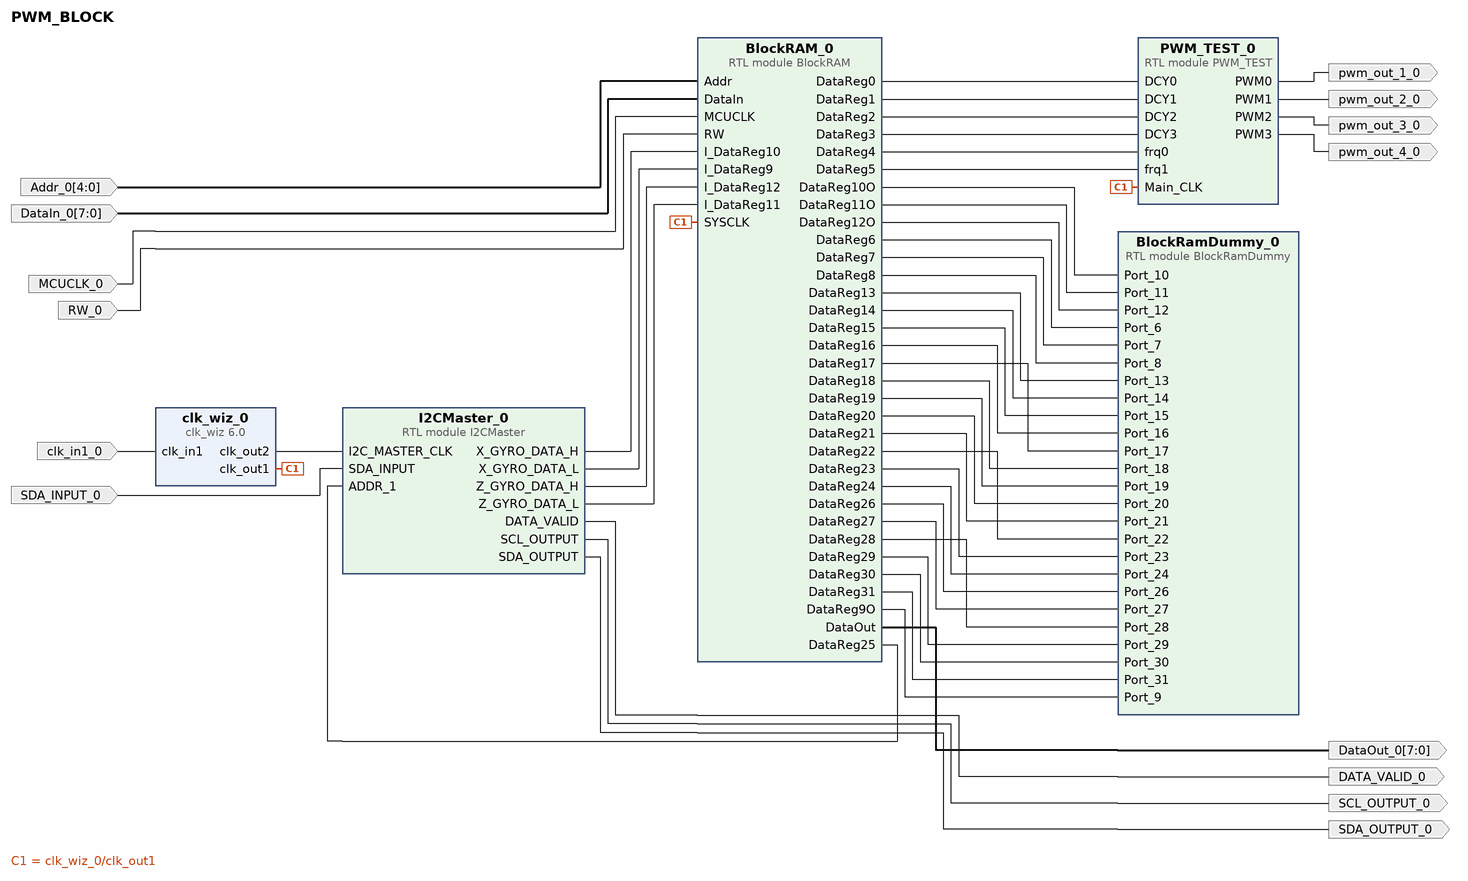
[diagram p0: block diagram of the top level]
# Vivado block design PWM_BLOCK, xc7a35tcpg236-1, Vivado 2022.2
create_bd_design PWM_BLOCK

create_bd_port -dir I -type clk clk_in1_0
set_property -dict {CONFIG.FREQ_HZ 12000000} [get_bd_ports clk_in1_0]
create_bd_port -dir O pwm_out_3_0
create_bd_port -dir O pwm_out_1_0
create_bd_port -dir O pwm_out_2_0
create_bd_port -dir O pwm_out_4_0
create_bd_port -dir I -from 7 -to 0 DataIn_0
create_bd_port -dir I RW_0
create_bd_port -dir I -from 4 -to 0 Addr_0
create_bd_port -dir I MCUCLK_0
create_bd_port -dir O -from 7 -to 0 DataOut_0
create_bd_port -dir I SDA_INPUT_0
create_bd_port -dir O SDA_OUTPUT_0
create_bd_port -dir O SCL_OUTPUT_0
create_bd_port -dir O DATA_VALID_0

create_bd_cell -type ip -vlnv xilinx.com:ip:clk_wiz:6.0 clk_wiz_0
set_property -dict [list \
  CONFIG.CLKIN1_JITTER_PS 833.33 \
  CONFIG.CLKIN2_JITTER_PS 1000.0 \
  CONFIG.CLKOUT1_JITTER 450.784 \
  CONFIG.CLKOUT1_PHASE_ERROR 686.541 \
  CONFIG.CLKOUT1_REQUESTED_OUT_FREQ 168 \
  CONFIG.CLKOUT2_JITTER 680.336 \
  CONFIG.CLKOUT2_PHASE_ERROR 686.541 \
  CONFIG.CLKOUT2_REQUESTED_OUT_FREQ 12 \
  CONFIG.CLKOUT2_USED true \
  CONFIG.MMCM_CLKFBOUT_MULT_F 63.000 \
  CONFIG.MMCM_CLKIN1_PERIOD 83.333 \
  CONFIG.MMCM_CLKIN2_PERIOD 10.0 \
  CONFIG.MMCM_CLKOUT0_DIVIDE_F 4.500 \
  CONFIG.MMCM_CLKOUT1_DIVIDE 63 \
  CONFIG.NUM_OUT_CLKS 2 \
  CONFIG.PRIM_IN_FREQ 12 \
  CONFIG.SECONDARY_IN_FREQ 100.000 \
  CONFIG.SECONDARY_SOURCE Single_ended_clock_capable_pin \
  CONFIG.USE_INCLK_SWITCHOVER false \
] [get_bd_cells clk_wiz_0]
create_bd_cell -type module -reference BlockRAM BlockRAM_0
create_bd_cell -type module -reference PWM_TEST PWM_TEST_0
create_bd_cell -type module -reference I2CMaster I2CMaster_0
create_bd_cell -type module -reference BlockRamDummy BlockRamDummy_0

# ---- connections ----

connect_bd_net -net Addr_0_1 [get_bd_ports Addr_0] [get_bd_pins BlockRAM_0/Addr]
connect_bd_net [get_bd_pins BlockRAM_0/DataOut] [get_bd_ports DataOut_0]
connect_bd_net [get_bd_pins BlockRAM_0/DataReg0] [get_bd_pins PWM_TEST_0/DCY0]
connect_bd_net [get_bd_pins BlockRAM_0/DataReg1] [get_bd_pins PWM_TEST_0/DCY1]
connect_bd_net [get_bd_pins BlockRAM_0/DataReg10O] [get_bd_pins BlockRamDummy_0/Port_10]
connect_bd_net [get_bd_pins BlockRAM_0/DataReg11O] [get_bd_pins BlockRamDummy_0/Port_11]
connect_bd_net [get_bd_pins BlockRAM_0/DataReg12O] [get_bd_pins BlockRamDummy_0/Port_12]
connect_bd_net [get_bd_pins BlockRAM_0/DataReg2] [get_bd_pins PWM_TEST_0/DCY2]
connect_bd_net [get_bd_pins BlockRAM_0/DataReg3] [get_bd_pins PWM_TEST_0/DCY3]
connect_bd_net [get_bd_pins BlockRAM_0/DataReg4] [get_bd_pins PWM_TEST_0/frq0]
connect_bd_net [get_bd_pins BlockRAM_0/DataReg5] [get_bd_pins PWM_TEST_0/frq1]
connect_bd_net [get_bd_pins BlockRAM_0/DataReg6] [get_bd_pins BlockRamDummy_0/Port_6]
connect_bd_net [get_bd_pins BlockRAM_0/DataReg7] [get_bd_pins BlockRamDummy_0/Port_7]
connect_bd_net [get_bd_pins BlockRAM_0/DataReg8] [get_bd_pins BlockRamDummy_0/Port_8]
connect_bd_net [get_bd_pins BlockRAM_0/DataReg13] [get_bd_pins BlockRamDummy_0/Port_13]
connect_bd_net [get_bd_pins BlockRAM_0/DataReg14] [get_bd_pins BlockRamDummy_0/Port_14]
connect_bd_net [get_bd_pins BlockRAM_0/DataReg15] [get_bd_pins BlockRamDummy_0/Port_15]
connect_bd_net [get_bd_pins BlockRAM_0/DataReg16] [get_bd_pins BlockRamDummy_0/Port_16]
connect_bd_net [get_bd_pins BlockRAM_0/DataReg17] [get_bd_pins BlockRamDummy_0/Port_17]
connect_bd_net [get_bd_pins BlockRAM_0/DataReg18] [get_bd_pins BlockRamDummy_0/Port_18]
connect_bd_net [get_bd_pins BlockRAM_0/DataReg19] [get_bd_pins BlockRamDummy_0/Port_19]
connect_bd_net [get_bd_pins BlockRAM_0/DataReg20] [get_bd_pins BlockRamDummy_0/Port_20]
connect_bd_net [get_bd_pins BlockRAM_0/DataReg21] [get_bd_pins BlockRamDummy_0/Port_21]
connect_bd_net [get_bd_pins BlockRAM_0/DataReg22] [get_bd_pins BlockRamDummy_0/Port_22]
connect_bd_net [get_bd_pins BlockRAM_0/DataReg23] [get_bd_pins BlockRamDummy_0/Port_23]
connect_bd_net [get_bd_pins BlockRAM_0/DataReg24] [get_bd_pins BlockRamDummy_0/Port_24]
connect_bd_net [get_bd_pins BlockRAM_0/DataReg25] [get_bd_pins I2CMaster_0/ADDR_1]
connect_bd_net [get_bd_pins BlockRAM_0/DataReg26] [get_bd_pins BlockRamDummy_0/Port_26]
connect_bd_net [get_bd_pins BlockRAM_0/DataReg27] [get_bd_pins BlockRamDummy_0/Port_27]
connect_bd_net [get_bd_pins BlockRAM_0/DataReg28] [get_bd_pins BlockRamDummy_0/Port_28]
connect_bd_net [get_bd_pins BlockRAM_0/DataReg29] [get_bd_pins BlockRamDummy_0/Port_29]
connect_bd_net [get_bd_pins BlockRAM_0/DataReg30] [get_bd_pins BlockRamDummy_0/Port_30]
connect_bd_net [get_bd_pins BlockRAM_0/DataReg31] [get_bd_pins BlockRamDummy_0/Port_31]
connect_bd_net [get_bd_pins BlockRAM_0/DataReg9O] [get_bd_pins BlockRamDummy_0/Port_9]
connect_bd_net -net DataIn_0_1 [get_bd_ports DataIn_0] [get_bd_pins BlockRAM_0/DataIn]
connect_bd_net [get_bd_pins I2CMaster_0/DATA_VALID] [get_bd_ports DATA_VALID_0]
connect_bd_net [get_bd_pins I2CMaster_0/SCL_OUTPUT] [get_bd_ports SCL_OUTPUT_0]
connect_bd_net [get_bd_pins I2CMaster_0/SDA_OUTPUT] [get_bd_ports SDA_OUTPUT_0]
connect_bd_net [get_bd_pins I2CMaster_0/X_GYRO_DATA_H] [get_bd_pins BlockRAM_0/I_DataReg10]
connect_bd_net [get_bd_pins I2CMaster_0/X_GYRO_DATA_L] [get_bd_pins BlockRAM_0/I_DataReg9]
connect_bd_net [get_bd_pins I2CMaster_0/Z_GYRO_DATA_H] [get_bd_pins BlockRAM_0/I_DataReg12]
connect_bd_net [get_bd_pins I2CMaster_0/Z_GYRO_DATA_L] [get_bd_pins BlockRAM_0/I_DataReg11]
connect_bd_net -net MCUCLK_0_1 [get_bd_ports MCUCLK_0] [get_bd_pins BlockRAM_0/MCUCLK]
connect_bd_net [get_bd_pins PWM_TEST_0/PWM0] [get_bd_ports pwm_out_1_0]
connect_bd_net [get_bd_pins PWM_TEST_0/PWM1] [get_bd_ports pwm_out_2_0]
connect_bd_net [get_bd_pins PWM_TEST_0/PWM2] [get_bd_ports pwm_out_3_0]
connect_bd_net [get_bd_pins PWM_TEST_0/PWM3] [get_bd_ports pwm_out_4_0]
connect_bd_net -net RW_0_1 [get_bd_ports RW_0] [get_bd_pins BlockRAM_0/RW]
connect_bd_net -net SDA_INPUT_0_1 [get_bd_ports SDA_INPUT_0] [get_bd_pins I2CMaster_0/SDA_INPUT]
connect_bd_net -net clk_in1_0_1 [get_bd_ports clk_in1_0] [get_bd_pins clk_wiz_0/clk_in1]
connect_bd_net [get_bd_pins clk_wiz_0/clk_out1] [get_bd_pins BlockRAM_0/SYSCLK] [get_bd_pins PWM_TEST_0/Main_CLK]
connect_bd_net [get_bd_pins clk_wiz_0/clk_out2] [get_bd_pins I2CMaster_0/I2C_MASTER_CLK]

validate_bd_design
save_bd_design
